# EAGLE design Pi Breakout (EAGLE 9.3.1)
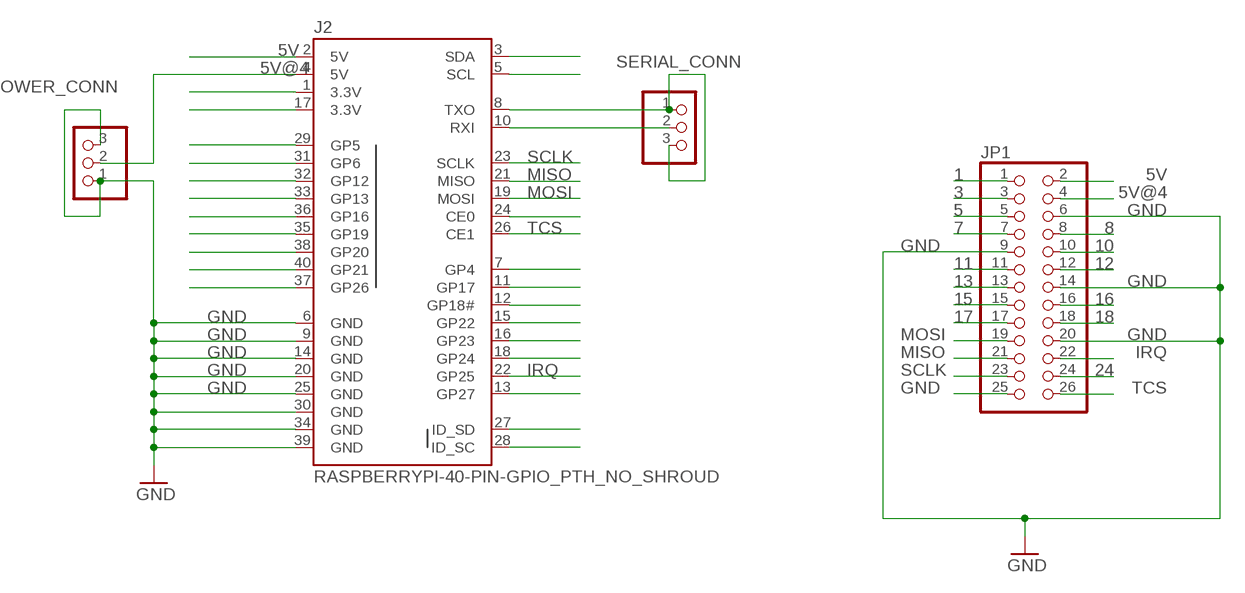
[diagram p0: schematic, sheet 1]

## Parts
J2  RASPBERRYPI-40-PIN-GPIO_PTH_NO_SHROUD  [2X20]
JP1  PINHD-2X13  [2X13]
POWER_CONN  PINHD-1X3  [1X03]
SERIAL_CONN  PINHD-1X3  [1X03]

## Nets
1: JP1.1
3: JP1.3
5: JP1.5
5V: J2.2(5V) JP1.2
5V@4: J2.4(5V) JP1.4 POWER_CONN.2
7: JP1.7
8: JP1.8
10: JP1.10
11: JP1.11
12: JP1.12
13: JP1.13
15: JP1.15
16: JP1.16
17: JP1.17
18: JP1.18
24: JP1.24
GND: J2.6(GND) J2.9(GND) J2.14(GND) J2.20(GND) J2.25(GND) J2.30(GND) J2.34(GND) J2.39(GND) JP1.6 JP1.9 JP1.14 JP1.20 JP1.25 POWER_CONN.1 POWER_CONN.3
GP22: J2.15(GP22)
IRQ: J2.22(GP25) JP1.22
MISO: J2.21(MISO) JP1.21
MOSI: J2.19(MOSI) JP1.19
N$1: J2.8(TXO) SERIAL_CONN.1 SERIAL_CONN.3
N$3: J2.1(3.3V)
N$4: J2.17(3.3V)
N$5: J2.29(GP5)
N$6: J2.31(GP6)
N$7: J2.32(GP12)
N$16: J2.37(GP26)
N$17: J2.33(GP13)
N$18: J2.36(GP16)
N$19: J2.40(GP21)
N$20: J2.35(GP19)
N$21: J2.38(GP20)
N$22: J2.28(ID_SC)
N$23: J2.27(ID_SD)
N$24: J2.13(GP27)
N$25: J2.3(SDA)
N$26: J2.18(GP24)
N$27: J2.16(GP23)
N$29: J2.5(SCL)
N$32: J2.10(RXI) SERIAL_CONN.2
N$33: J2.24(CE0)
N$37: J2.12(GP18#)
N$38: J2.11(GP17)
N$40: J2.7(GP4)
SCLK: J2.23(SCLK) JP1.23
TCS: J2.26(CE1) JP1.26

## Library data of the parts
J2 = SparkFun-Connectors:RASPBERRYPI-40-PIN-GPIO: Raspberry Pi GPIO Header 2x20 pin connector, as found on B, B+, A+ models. Both shrouded PTH and SMT versions available. SparkFun Products: GPIO Shrouded Header <https://www.sparkfun.com/products/13054>- PTH SparkFun Pi Wedge (Preassembled) <https://www.sparkfun.com/products/13717>
JP1 = pinhead:PINHD-2X13: PIN HEADER
POWER_CONN SERIAL_CONN = pinhead:PINHD-1X3: PIN HEADER

## Board
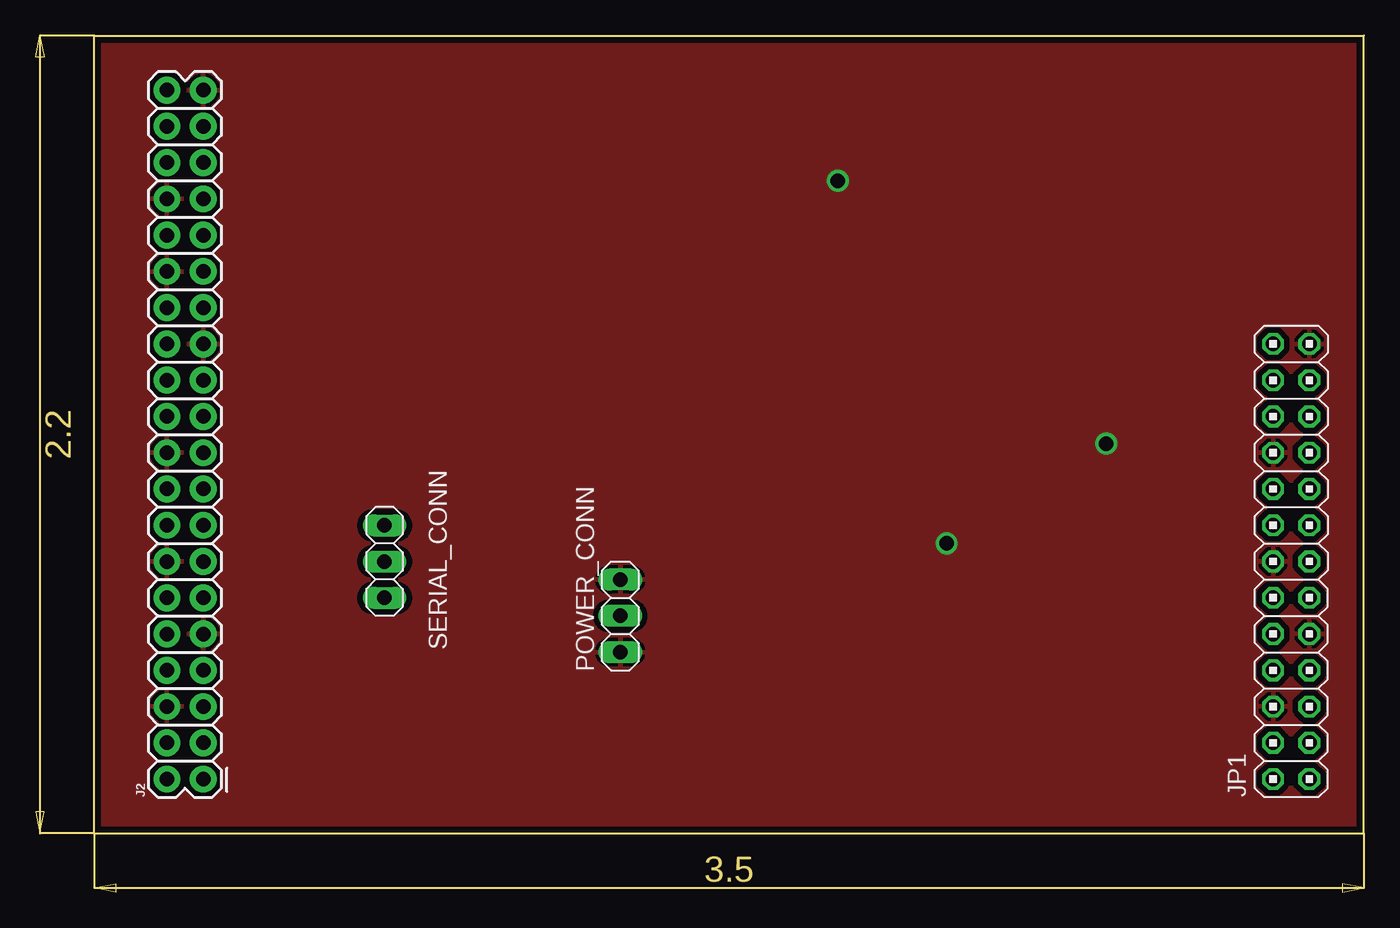
[diagram p1: board, top side]
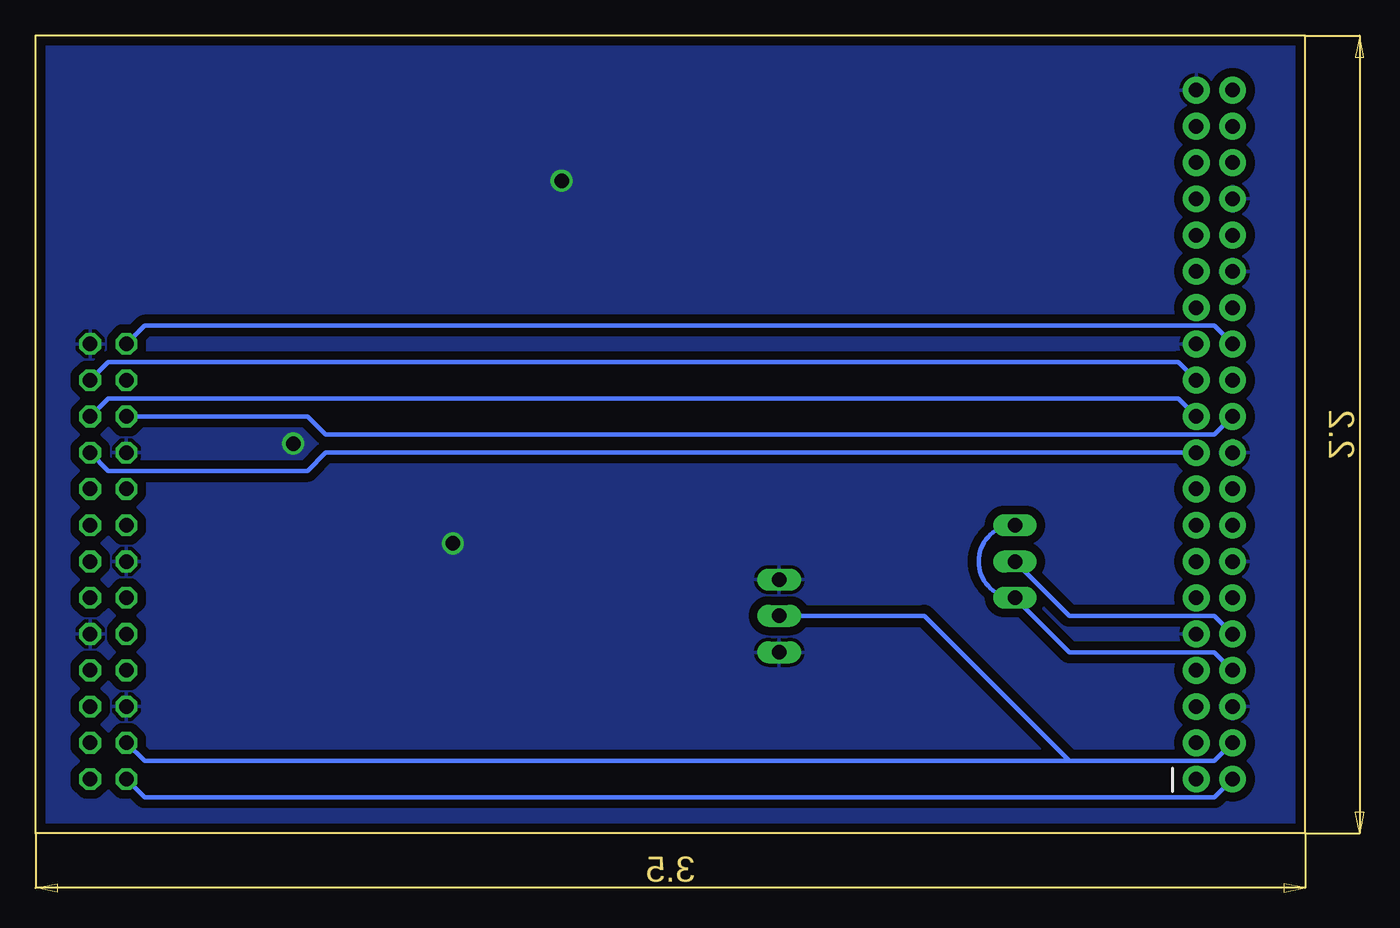
[diagram p2: board, bottom side, seen from below]

Size 88.9 x 55.88 mm. Coordinates in mm from the lower left corner, seen from the top.
Outline: 0,0 88.9,0 88.9,55.88 0,55.88 0,0
Copper layers (1*16): Top 0.035mm / dielectric 1.5mm / Bottom 0.035mm
Design rules "default *": minimum track width 6mil, minimum drill 0.35mm, track to track 6mil, track to pad 6mil, pad to pad 6mil, via to via 6mil, smd to smd 6mil, copper to edge 1mil, drill to drill 6mil, minimum pad ring 10mil, minimum via ring 8mil, stop-mask expansion 4mil, vias tented up to drill 0mil, thermal gap 10mil

### Footprints (pad centres in the part's own frame; a part is rotated, then mirrored left to right if it is on the bottom)
2X20 = drill 1.016 pad 1.88: 1 0,0; 2 0,2.54; 3 2.54,0; 4 2.54,2.54; 5 5.08,0; 6 5.08,2.54; 7 7.62,0; 8 7.62,2.54; 9 10.16,0; 10 10.16,2.54; 11 12.7,0; 12 12.7,2.54; 13 15.24,0; 14 15.24,2.54; 15 17.78,0; 16 17.78,2.54; 17 20.32,0; 18 20.32,2.54; 19 22.86,0; 20 22.86,2.54; 21 25.4,0; 22 25.4,2.54; 23 27.94,0; 24 27.94,2.54; 25 30.48,0; 26 30.48,2.54; 27 33.02,0; 28 33.02,2.54; 29 35.56,0; 30 35.56,2.54; 31 38.1,0; 32 38.1,2.54; 33 40.64,0; 34 40.64,2.54; 35 43.18,0; 36 43.18,2.54; 37 45.72,0; 38 45.72,2.54; 39 48.26,0; 40 48.26,2.54
2X13 = drill 1.016 octagon: 1 -15.24,-1.27; 2 -15.24,1.27; 3 -12.7,-1.27; 4 -12.7,1.27; 5 -10.16,-1.27; 6 -10.16,1.27; 7 -7.62,-1.27; 8 -7.62,1.27; 9 -5.08,-1.27; 10 -5.08,1.27; 11 -2.54,-1.27; 12 -2.54,1.27; 13 0,-1.27; 14 0,1.27; 15 2.54,-1.27; 16 2.54,1.27; 17 5.08,-1.27; 18 5.08,1.27; 19 7.62,-1.27; 20 7.62,1.27; 21 10.16,-1.27; 22 10.16,1.27; 23 12.7,-1.27; 24 12.7,1.27; 25 15.24,-1.27; 26 15.24,1.27
1X03 = drill 1.016 long: 1 -2.54,0; 2 0,0; 3 2.54,0

### Placement (x,y rotation side)
J2  7.62,3.81 90 top
JP1  83.82,19.05 90 top
POWER_CONN  36.83,15.24 90 top
SERIAL_CONN  20.32,19.05 270 top

### Tracks (layer width: path | path; a pad name or v marks a point on that pad's centre or on a via)
5V
  Bottom 0.305: J2.2 6.35,2.54 81.28,2.54 JP1.2
5V@4
  Bottom 0.305: J2.4 6.35,5.08 16.51,5.08 | 16.51,5.08 81.28,5.08 JP1.4 | POWER_CONN.2 26.67,15.24 16.51,5.08
GND  (via drill 1.02)
  other vias: 70.87,27.3 59.69,20.32 52.07,45.72
  pour Bottom (isolate 0.61): 0,55.88 88.9,55.88 88.9,0 0,0
  pour Top (isolate 0.406): 0,0 0,55.88 88.9,55.88 88.9,0
IRQ
  Bottom 0.305: J2.22 6.35,27.94 68.58,27.94 69.85,29.21 JP1.22
MISO
  Bottom 0.305: JP1.21 83.82,30.48 8.89,30.48 J2.21
MOSI
  Bottom 0.305: J2.19 68.58,26.67 69.85,25.4 83.82,25.4 JP1.19
N$1
  Bottom 0.305: J2.8 6.35,12.7 16.51,12.7 SERIAL_CONN.3 arc90 22.86,19.05 arc90 SERIAL_CONN.1
N$32
  Bottom 0.305: J2.10 6.35,15.24 16.51,15.24 SERIAL_CONN.2
SCLK
  Bottom 0.305: JP1.23 83.82,33.02 8.89,33.02 J2.23
TCS
  Bottom 0.305: J2.26 6.35,35.56 81.28,35.56 JP1.26